# EAGLE design LB_BIT_o13_FAN-v03(rev4_4) (EAGLE 6.6.0)
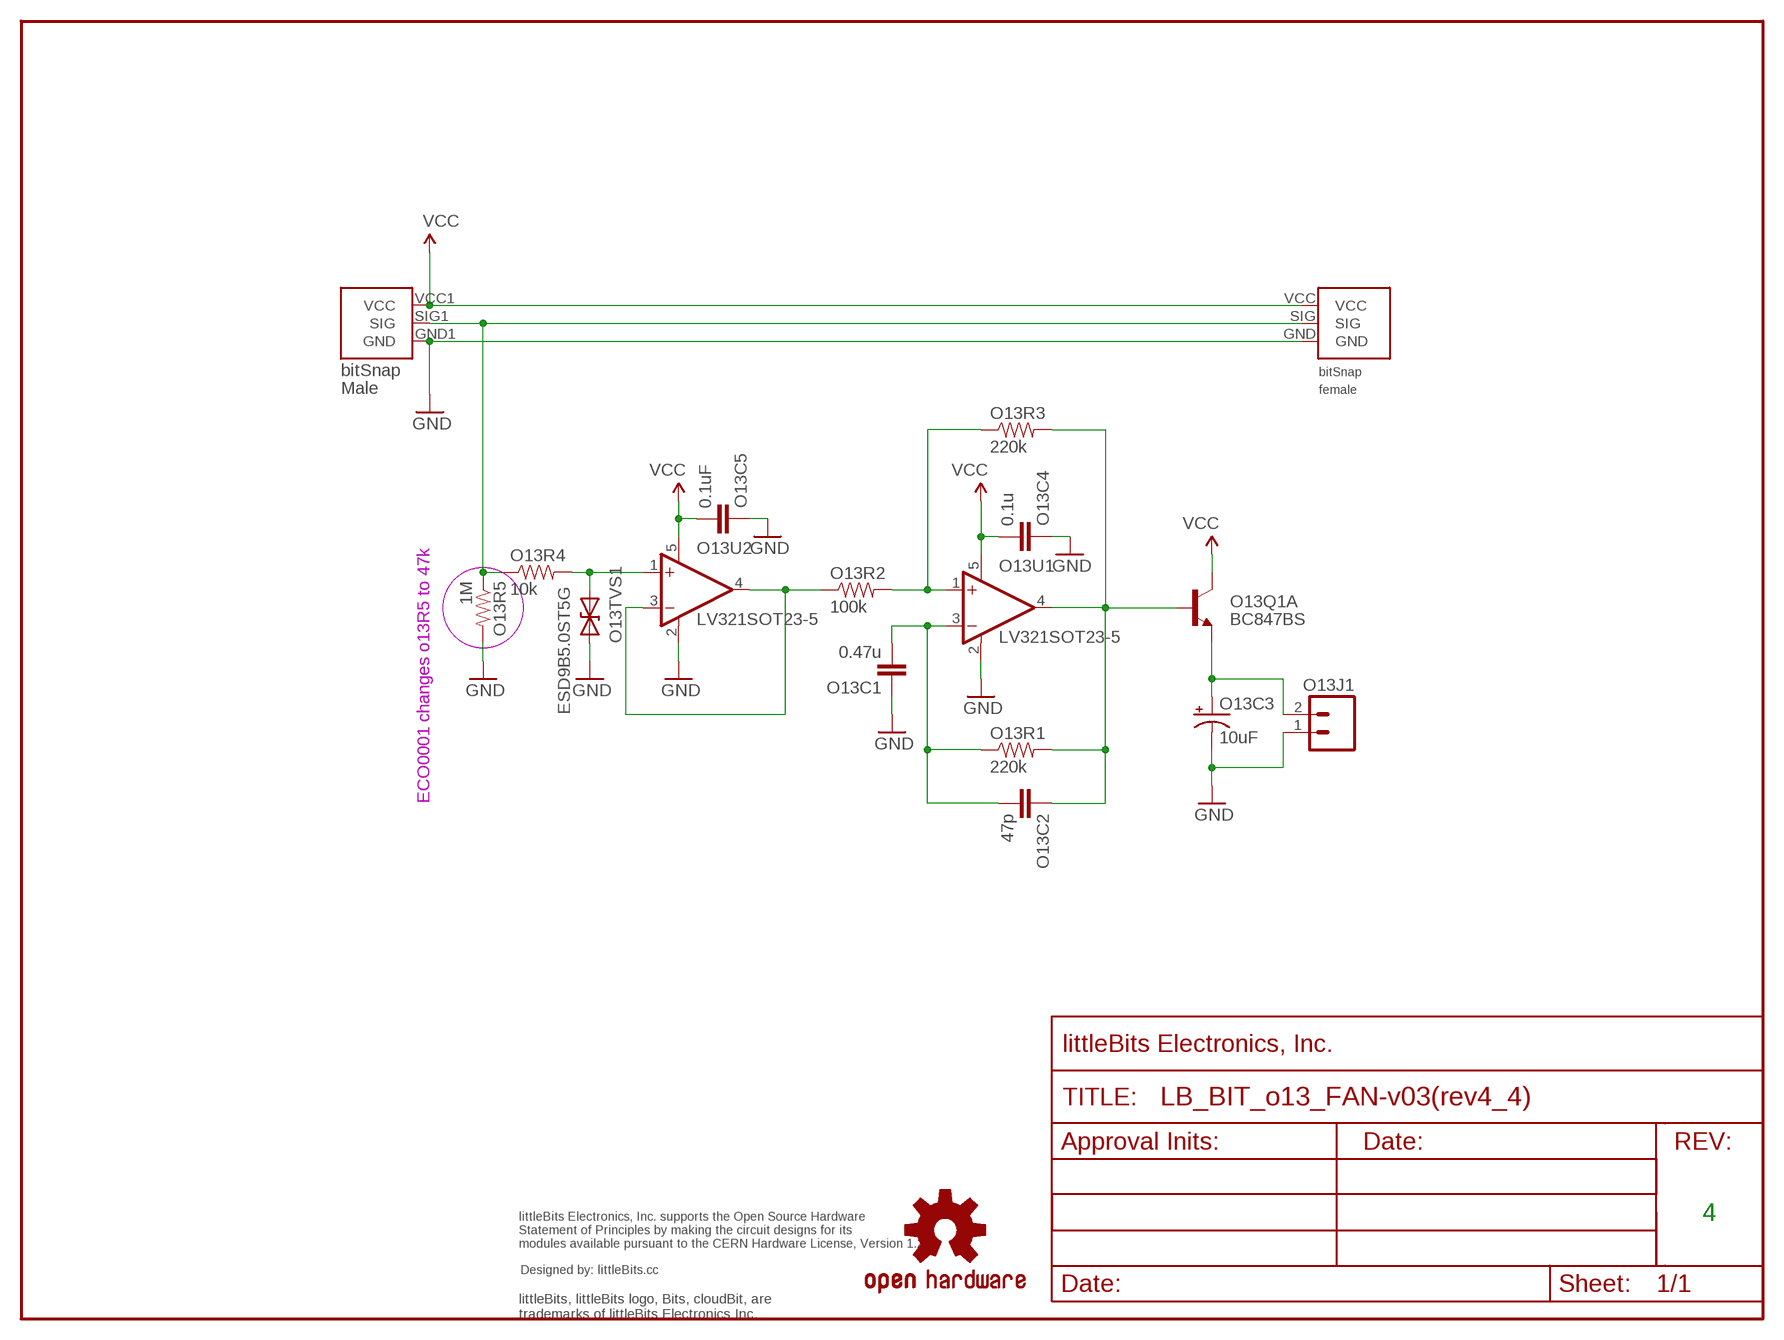
[diagram p0: schematic, sheet 1]

## Parts
O13BSF1  BITSNAP_V03_FEMALE  [BITSNAP_V03_FEMALE]
O13BSM1  BITSNAP_V03_MALE  [BITSNAP_V03_MALE]
O13C1  0.47u  CAPCAP-0603  [CAP-0603]
O13C2  47p  CAPCAP-0603  [CAP-0603]
O13C3  10uF  CAP_POL3216  [EIA3216]
O13C4  0.1u  CAPCAP-0603  [CAP-0603]
O13C5  0.1uF  CAPCAP-0603  [CAP-0603]
O13J1  HDR-2JST-2-SMD  [JST-2-SMD]
O13Q1  BC847BS  TRANS-BJT_NPN-DUAL-BC847BS  [SOT-363_PHILLIPS]
O13R1  220k  RESISTOR0603  [RES-0603]
O13R2  100k  RESISTOR0603  [RES-0603]
O13R3  220k  RESISTOR0603  [RES-0603]
O13R4  10k  RESISTOR0603  [RES-0603]
O13R5  1M  RESISTOR0603  [RES-0603]
O13TVS1  ESD9B5.0ST5G  DIODE-TVSSOD-923  [SOD-923]
O13U1  LV321SOT23-5  [SOT23-5]
O13U2  LV321SOT23-5  [SOT23-5]
U$1  OSHWCREDIT  [OSHWCREDIT]
U$2  FRAME-LETTER-OHWOHW  [FABDWG01-OHW]
U$3  OSHW-LOGOL  [OSHW-LOGO-L]

## Nets
GND: O13BSF1.GND O13BSM1.GND1(GND) O13C1.1 O13C3.- O13C4.1 O13C5.1 O13J1.1 O13R5.2 O13TVS1.1(A) O13U1.2(V-) O13U2.2(V-)
N$1: O13R2.2 O13R3.1 O13U1.1(+IN)
N$2: O13R2.1 O13U2.3(-IN) O13U2.4(OUT)
N$3: O13C3.+ O13J1.2 O13Q1.1(A:E)
N$4: O13C1.2 O13C2.2 O13R1.1 O13U1.3(-IN)
N$5: O13R4.2 O13TVS1.2(C) O13U2.1(+IN)
N$9: O13C2.1 O13Q1.2(A:B) O13R1.2 O13R3.2 O13U1.4(OUT)
SIG: O13BSF1.SIG O13BSM1.SIG1(SIG) O13R4.1 O13R5.1
VCC: O13BSF1.VCC O13BSM1.VCC1(VCC) O13C4.2 O13C5.2 O13Q1.6(A:C) O13U1.5(V+) O13U2.5(V+)
Unconnected: O13Q1.3(B:C) O13Q1.4(B:E) O13Q1.5(B:B)

## Notes on the sheet
- ECO0001 changes o13R5 to 47k
- 4

## Library data of the parts
O13BSF1 = bitSnap:BITSNAP_V03_FEMALE
O13BSM1 = bitSnap:BITSNAP_V03_MALE
O13C1 O13C2 O13C4 O13C5 = LITTLEBITS:CAP
O13C3 = LITTLEBITS:CAP_POL
O13J1 = LITTLEBITS:HDR-2
O13Q1 = LITTLEBITS:TRANS-BJT_NPN-DUAL
O13R1-O13R5 = LITTLEBITS:RESISTOR
O13TVS1 = LITTLEBITS:DIODE-TVS: Bidirectional Transient Voltage Suppression Diode: Device conducts in avalanche mode after reaching a part dependent voltage threshold. Used for limiting voltage spikes on ESD sensitive inputs and outputs.; IEC_ESD_PROT0: +/-18kV; LB_PN: ?; MPN: ESD9B5.0ST5G; V_CLAMP: ?; V_OPERATION: 5V
O13U1 O13U2 = LITTLEBITS:LV321
U$1 = LITTLEBITS:OSHWCREDIT
U$2 = LITTLEBITS:FRAME-LETTER-OHW
U$3 = LITTLEBITS:OSHW-LOGO: Open Source Hardware Logo This logo indicates the piece of hardware it is found on incorporates a OSHW license and/or adheres to the definition of open source hardware found here: http://freedomdefined.org/OSHW

## Board
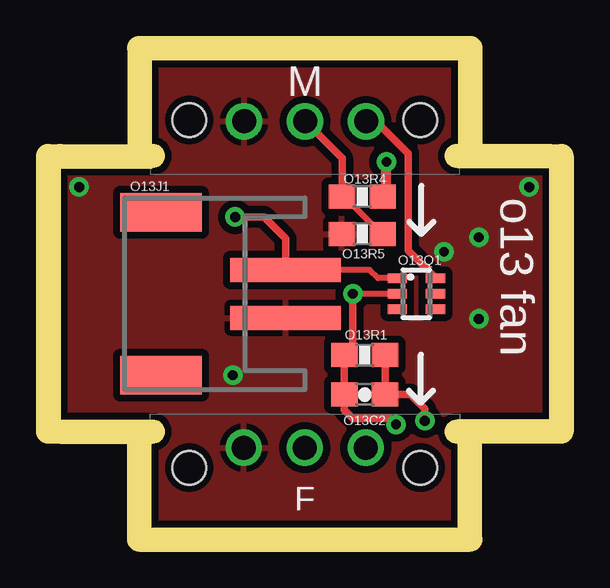
[diagram p1: board, top side]
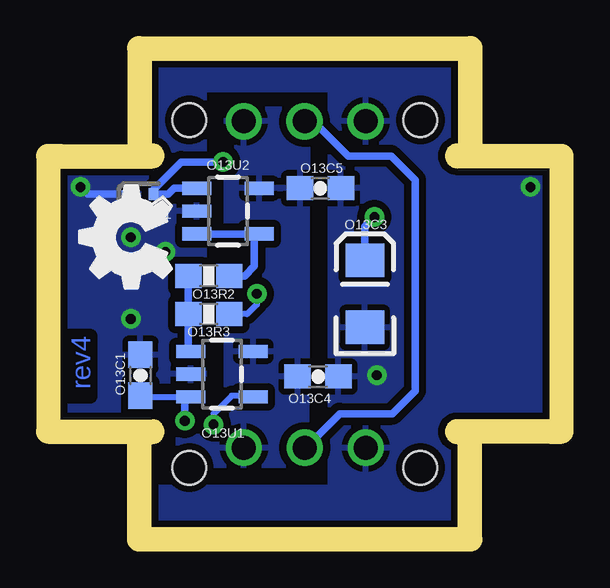
[diagram p2: board, bottom side, seen from below]

Size 20.4 x 19.5 mm. Coordinates in mm from the lower left corner, seen from the top.
Outline: 0,15 0,4.5
Outline: 20.4,4.5 20.4,15
Copper layers (1*16): Top 0.035mm / dielectric 1.5mm / Bottom 0.035mm
Design rules "default": minimum track width 0.2mm, minimum drill 16mil, track to track 0.2mm, track to pad 0.2mm, pad to pad 0.2mm, via to via 0.2mm, smd to smd 0mil, copper to edge 8mil, drill to drill 8mil, minimum pad ring 10mil, minimum via ring 8mil, stop-mask expansion 4mil, vias tented up to drill 0mil, thermal gap 10mil
Milling: 6 lines

### Footprints (pad centres in the part's own frame; a part is rotated, then mirrored left to right if it is on the bottom)
BITSNAP_V03_FEMALE = drill 1: GND 3.91,3.33; SIG 6.45,3.33; VCC 8.99,3.33 | hole 1.4: 1.63,2.5; 11.27,2.5
BITSNAP_V03_MALE = drill 1: GND1 8.98,2.56; SIG1 6.44,2.56; VCC1 3.9,2.56 | hole 1.4: 11.27,2.5; 1.63,2.5
CAP-0603 = smd 1.1 x 1: 1 -0.85,0; 2 0.85,0
EIA3216 = smd 1.4 x 1.6: + 1.4,0; - -1.4,0
JST-2-SMD = smd 1 x 4.6: 1 -1,-3.7; 2 1,-3.7 | smd 1.6 x 3.4: NC1 -3.4,1.5; NC2 3.4,1.5
SOT-363_PHILLIPS = smd 0.4 x 0.8: 1 -0.65,-0.8; 2 0,-0.8; 3 0.65,-0.8; 4 0.65,0.8; 5 0,0.8; 6 -0.65,0.8
RES-0603 = smd 1.1 x 1: 1 -0.85,0; 2 0.85,0
SOD-923 = smd 0.4 x 0.5: 1 -0.5,0; 2 0.5,0
SOT23-5 = smd 0.55 x 1.2: 1 -0.95,-1.3; 2 0,-1.3; 3 0.95,-1.3; 4 0.95,1.3; 5 -0.95,1.3

### Placement (x,y rotation side)
O13BSF1  3.75,0 0 top
O13BSM1  16.65,19.5 180 top
O13C1  17.05,6.35 270 bottom
O13C2  12.7,5.55 0 top
O13C3  7.7,9.75 90 bottom
O13C4  9.65,6.3 180 bottom
O13C5  9.55,14.15 180 bottom
O13J1  5.7,9.75 90 top
O13Q1  14.85,9.75 270 top
O13R1  12.7,7.2 180 top
O13R2  14.2,10.5 180 bottom
O13R3  14.2,8.9 0 bottom
O13R4  12.6,13.8 0 top
O13R5  12.6,12.25 180 top
O13TVS1  17,13.9 0 bottom
O13U1  13.65,6.4 270 bottom
O13U2  13.4,13.2 270 bottom
U$1  -111.05,-69.35 0 top  (outside the outline)
U$2  -19.45,-3.2 0 top  (outside the outline)
U$3  -52.2,-72.65 0 top  (outside the outline)
U$6  [OSHW_FILLX150_NOTEXT]  15.76,9.16 0 top

### Tracks (layer width: path | path; a pad name or v marks a point on that pad's centre or on a via)
GND  (via drill 0.41)
  Bottom 0.305: O13TVS1.1 19.25,13.9 v19.55,14.2
  other vias: 17.45,8.7 7.2,6.35 0.8,14.2 17.45,12.1 16,11.5
  pour Bottom (isolate 0.305): 0.1,19.42 0.1,0.1 20.3,0.1 20.3,1.7 9.15,1.7 9.15,18.25 14.4,18.25 14.4,6.1 16.35,6.1 16.35,1.95 20.25,1.95 20.3,19.42
  pour Top (isolate 0.305): 0.15,19.37 0.15,0.15 20.27,0.15 20.27,19.37
N$1
  Bottom 0.305: O13R2.2 O13R3.1 15.05,7.45 O13U1.1
N$2
  Bottom 0.305: O13U2.3 12.3,12.25 | O13U2.4 12.3,12.25 | 12.3,12.25 12.3,10.9 12.7,10.5 O13R2.1
N$3  (via drill 0.41)
  Top 0.254: O13Q1.1 13.25,10.4 12.9,10.75 O13J1.2
  Top 0.305: O13J1.2 9.4,12.05 8.5,12.95 v7.3,12.95
  Bottom 0.305: v7.3,12.95 7.7,12.55 O13C3.+
N$4  (via drill 0.41)
  Top 0.305: O13R1.1 O13C2.2 14.6,5.55 15.2,4.95 v15.2,4.45
  Bottom 0.254: O13C1.2 17,5.45 O13U1.3
  Bottom 0.305: v15.2,4.45 15.2,5.45 O13U1.3
N$5  (via drill 0.41 pad 0.81)
  Top 0.406: O13R4.2 13.6,13.95 v13.6,15.25
  Bottom 0.305: v13.6,15.25 15.35,15.25 16.5,14.1 O13TVS1.2 15.9,13.9 15.65,14.15 O13U2.1
N$9  (via drill 0.41)
  Top 0.254: O13Q1.2 v12.2,9.75
  Top 0.305: v12.2,9.75 12.2,7.55 O13R1.2 O13C2.1 11.85,4.9 12.2,4.55 13.75,4.55 v14,4.3
  Bottom 0.254: v12.2,9.75 12.2,9.3 12.6,8.9 O13R3.2 | O13U1.4 12.8,5.5 13.25,5.5 14,4.75 v14,4.3
SIG
  Top 0.254: O13R5.1 13.4,12.25 11.85,13.8 O13R4.1
  Top 0.305: O13BSM1.SIG1 11.75,15.4 O13R4.1
  Bottom 0.305: O13BSF1.SIG 10.17,3.33 8.75,4.75 6.55,4.75 5.6,5.7 5.6,14.5 6.6,15.5 8.4,15.5 9.84,16.94 O13BSM1.SIG1
VCC
  Top 0.305: 15.65,10.45 O13Q1.6 14.5,11.55 14.5,15.6 13.16,16.94 O13BSM1.VCC1
  pour Bottom (isolate 0.305): 10.05,17.45 13.5,17.45 13.5,5.05 15.5,5.1 15.5,2.6 10.1,2.6

### Text on the board
Bottom: rev4
tPlace: o13 fan
Milling: 1mm DIA. ROUTER PATH
Reference: SMALL
dxf: 4 | SPEED CONTROLLED FAN BIT